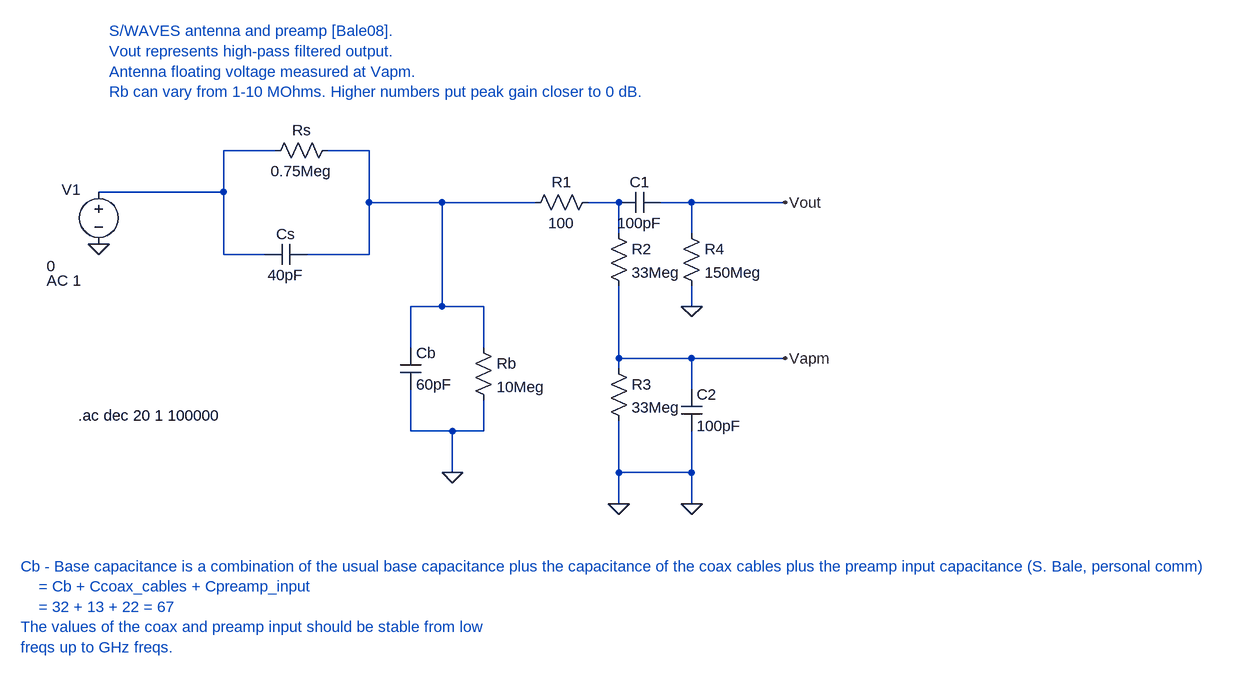
[diagram p0: schematic stereo_ant_preamp_LTspice.asc]
stereo_ant_preamp_LTspice.asc, the LTspice schematic file:
Version 4
SHEET 1 1232 856
WIRE -192 112 -272 112
WIRE -48 112 -112 112
WIRE -272 176 -272 112
WIRE -272 176 -464 176
WIRE -48 192 -48 112
WIRE 64 192 -48 192
WIRE 208 192 64 192
WIRE 336 192 288 192
WIRE 352 192 336 192
WIRE 448 192 400 192
WIRE 592 192 448 192
WIRE 336 240 336 192
WIRE 448 240 448 192
WIRE -272 272 -272 176
WIRE -208 272 -272 272
WIRE -48 272 -48 192
WIRE -48 272 -144 272
WIRE 64 352 64 192
WIRE 64 352 16 352
WIRE 128 352 64 352
WIRE 448 352 448 320
WIRE 16 416 16 352
WIRE 128 416 128 352
WIRE 336 432 336 320
WIRE 448 432 336 432
WIRE 592 432 448 432
WIRE 336 448 336 432
WIRE 448 480 448 432
WIRE 16 544 16 480
WIRE 80 544 16 544
WIRE 128 544 128 496
WIRE 128 544 80 544
WIRE 80 608 80 544
WIRE 336 608 336 528
WIRE 448 608 448 544
WIRE 448 608 336 608
WIRE 336 656 336 608
WIRE 448 656 448 608
FLAG 80 608 0
FLAG 336 656 0
FLAG 448 656 0
FLAG 448 352 0
FLAG 592 192 Vout
FLAG 592 432 Vapm
FLAG -464 256 0
SYMBOL voltage -464 160 R0
WINDOW 0 -57 12 Left 2
WINDOW 3 -80 130 Left 2
WINDOW 123 -80 152 Left 2
SYMATTR InstName V1
SYMATTR Value 0
SYMATTR Value2 AC 1
SYMBOL cap -144 256 R90
WINDOW 0 0 32 VBottom 2
WINDOW 3 32 32 VTop 2
SYMATTR InstName Cs
SYMATTR Value 40pF
SYMBOL res -208 128 R270
WINDOW 0 32 56 VTop 2
WINDOW 3 0 56 VBottom 2
SYMATTR InstName Rs
SYMATTR Value 0.75Meg
SYMBOL cap 0 416 R0
SYMATTR InstName Cb
SYMATTR Value 60pF
SYMBOL res 112 400 R0
SYMATTR InstName Rb
SYMATTR Value 10Meg
SYMBOL res 304 176 R90
WINDOW 0 0 56 VBottom 2
WINDOW 3 32 56 VTop 2
SYMATTR InstName R1
SYMATTR Value 100
SYMBOL cap 400 176 R90
WINDOW 0 0 32 VBottom 2
WINDOW 3 32 32 VTop 2
SYMATTR InstName C1
SYMATTR Value 100pF
SYMBOL res 432 224 R0
SYMATTR InstName R4
SYMATTR Value 150Meg
SYMBOL res 320 224 R0
SYMATTR InstName R2
SYMATTR Value 33Meg
SYMBOL res 320 432 R0
SYMATTR InstName R3
SYMATTR Value 33Meg
SYMBOL cap 432 480 R0
SYMATTR InstName C2
SYMATTR Value 100pF
TEXT -448 -72 Left 2 ;S/WAVES antenna and preamp [Bale08].\nVout represents high-pass filtered output.\nAntenna floating voltage measured at Vapm.\nRb can vary from 1-10 MOhms. Higher numbers put peak gain closer to 0 dB.
TEXT -496 520 Left 2 !.ac dec 20 1 100000
TEXT -584 752 Left 2 ;Cb - Base capacitance is a combination of the usual base capacitance plus the capacitance of the coax cables plus the preamp input capacitance (S. Bale, personal comm)\n	= Cb + Ccoax_cables + Cpreamp_input\n	= 32 + 13 + 22 = 67\nThe values of the coax and preamp input should be stable from low\nfreqs up to GHz freqs.

The netlist it stands for:
* stereo_ant_preamp_LTspice.asc
V1 N001 0 0 AC 1
Cs N002 N001 40pF
Rs N001 N002 0.75Meg
Cb N002 0 60pF
Rb N002 0 10Meg
R1 N003 N002 100
C1 Vout N003 100pF
R4 Vout 0 150Meg
R2 N003 Vapm 33Meg
R3 Vapm 0 33Meg
C2 Vapm 0 100pF
* S/WAVES antenna and preamp [Bale08].
* Vout represents high-pass filtered output.
* Antenna floating voltage measured at Vapm.
* Rb can vary from 1-10 MOhms. Higher numbers put peak gain closer to 0 dB.
.ac dec 20 1 100000
* Cb - Base capacitance is a combination of the usual base capacitance plus the capacitance of the coax cables plus the preamp input capacitance (S. Bale, personal comm)
* 	= Cb + Ccoax_cables + Cpreamp_input
* 	= 32 + 13 + 22 = 67
* The values of the coax and preamp input should be stable from low
* freqs up to GHz freqs.
.backanno
.end